# Altium schematic sheet Audio.SchDoc
size A4
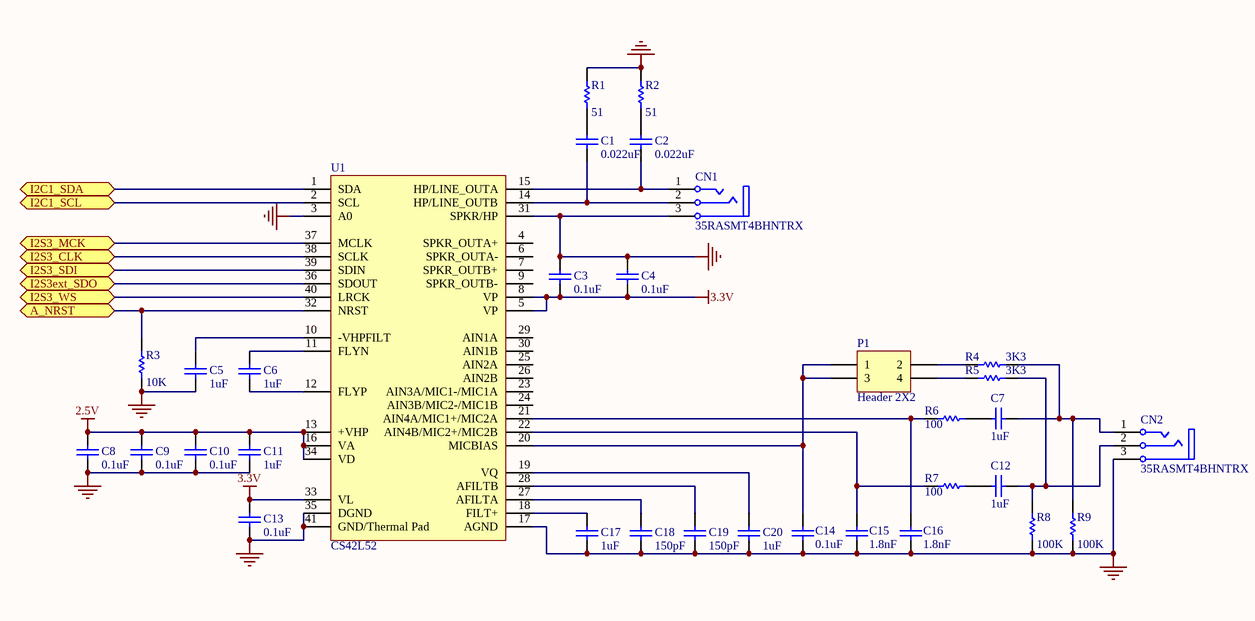
[diagram p0: Audio.SchDoc]

## Parts
C1  value 0.022uF  [CAPC2012N]  (hidden comment: Cap)
C2  value 0.022uF  [CAPC2012N]  (hidden comment: Cap)
C3  value 0.1uF  [CAPC2012N]  (hidden comment: Cap)
C4  value 0.1uF  [CAPC2012N]  (hidden comment: Cap)
C5  value 1uF  [CAPC3216N]  (hidden comment: Cap)
C6  value 1uF  [CAPC3216N]  (hidden comment: Cap)
C7  value 1uF  [CAPC3216N]  (hidden comment: Cap)
C8  value 0.1uF  [CAPC2012N]  (hidden comment: Cap)
C9  value 0.1uF  [CAPC2012N]  (hidden comment: Cap)
C10  value 0.1uF  [CAPC2012N]  (hidden comment: Cap)
C11  value 1uF  [CAPC3216N]  (hidden comment: Cap)
C12  value 1uF  [CAPC3216N]  (hidden comment: Cap)
C13  value 0.1uF  [CAPC2012N]  (hidden comment: Cap)
C14  value 0.1uF  [CAPC2012N]  (hidden comment: Cap)
C15  value 1.8nF  [CAPC2012N]  (hidden comment: Cap)
C16  value 1.8nF  [CAPC2012N]  (hidden comment: Cap)
C17  value 1uF  [CAPC3216N]  (hidden comment: Cap)
C18  value 150pF  [CAPC2012N]  (hidden comment: Cap)
C19  value 150pF  [CAPC2012N]  (hidden comment: Cap)
C20  value 1uF  [CAPC3216N]  (hidden comment: Cap)
CN1  35RASMT4BHNTRX  [35RASMT4BHNTRX]
CN2  35RASMT4BHNTRX  [35RASMT4BHNTRX]
P1  Header 2X2  [HDR2X2]
R1  value 51  [RESC2012N]  (hidden comment: 1206)
R2  value 51  [RESC2012N]  (hidden comment: 1206)
R3  value 10K  [RESC2012N]  (hidden comment: 1206)
R4  value 3K3  [RESC2012N]  (hidden comment: 1206)
R5  value 3K3  [RESC2012N]  (hidden comment: 1206)
R6  value 100  [RESC2012N]  (hidden comment: 1206)
R7  value 100  [RESC2012N]  (hidden comment: 1206)
R8  value 100K  [RESC2012N]  (hidden comment: 1206)
R9  value 100K  [RESC2012N]  (hidden comment: 1206)
U1  CS42L52  [QFN50P600X600X100-40M]

## Ports
A_NRST (bidir), I2C1_SCL (bidir), I2C1_SDA (bidir), I2S3_CLK (bidir), I2S3_MCK (bidir), I2S3_SDI (bidir), I2S3_WS (bidir), I2S3ext_SDO (bidir)

## Nets
2.5V: C8.2 C9.2 C10.2 C11.2 U1.13(+VHP) U1.16(VA) U1.34(VD)
3.3V: C3.1 C4.1 C13.2 U1.5(VP) U1.8(VP) U1.33(VL)
DGND: C3.2 C4.2 C5.1 C8.1 C9.1 C10.1 C11.1 C13.1 C14.2 C15.2 C16.2 C17.1 C18.1 C19.1 C20.1 CN1.3(S) CN2.3(S) R1.2 R2.2 R3.1 R8.1 R9.1 U1.3(A0) U1.17(AGND) U1.31(SPKR/HP) U1.35(DGND) U1.41(GND/Thermal_Pad)
A_NRST: R3.2 U1.32(NRST) ; port A_NRST
I2C1_SCL: U1.2(SCL) ; port I2C1_SCL
I2C1_SDA: U1.1(SDA) ; port I2C1_SDA
I2S3_CLK: U1.38(SCLK) ; port I2S3_CLK
I2S3_MCK: U1.37(MCLK) ; port I2S3_MCK
I2S3_SDI: U1.39(SDIN) ; port I2S3_SDI
I2S3_WS: U1.40(LRCK) ; port I2S3_WS
I2S3ext_SDO: U1.36(SDOUT) ; port I2S3ext_SDO
NetC1_1: C1.1 CN1.2(R) U1.14(HP/LINE_OUTB)
NetC1_2: C1.2 R1.1
NetC2_1: C2.1 CN1.1(T) U1.15(HP/LINE_OUTA)
NetC2_2: C2.2 R2.1
NetC5_2: C5.2 U1.10(-VHPFILT)
NetC6_1: C6.1 U1.12(FLYP)
NetC6_2: C6.2 U1.11(FLYN)
NetC7_1: C7.1 CN2.1(T) R4.1 R9.2
NetC7_2: C7.2 R6.1
NetC12_1: C12.1 CN2.2(R) R5.1 R8.2
NetC12_2: C12.2 R7.1
NetC14_1: C14.1 P1.1 P1.3 U1.20(MICBIAS)
NetC15_1: C15.1 R7.2 U1.22(AIN4B/MIC2+/MIC2B)
NetC16_1: C16.1 R6.2 U1.21(AIN4A/MIC1+/MIC2A)
NetC17_2: C17.2 U1.18(FILT+)
NetC18_2: C18.2 U1.27(AFILTA)
NetC19_2: C19.2 U1.28(AFILTB)
NetC20_2: C20.2 U1.19(VQ)
NetP1_2: P1.2 R4.2
NetP1_4: P1.4 R5.2

Not connected (* = marked no-connect by the designer): U1 4(SPKR_OUTA+) 6(SPKR_OUTA-) 7(SPKR_OUTB+) 9(SPKR_OUTB-) 23(AIN3A/MIC1-/MIC1A) 24(AIN3B/MIC2-/MIC1B) 25(AIN2A) 26(AIN2B) 29(AIN1A) 30(AIN1B)

## Library data of the parts
C1-C20 = Cap: Capacitor
CN1 CN2 = Phonejack3: 3.5mm Stereo Jack
P1 = Header 2X2: Header, 2-Pin, Dual row
R1-R9 = Res: Resistor
U1 = CS42L52: Low-power, Stereo CODEC w/ Headphone & Speaker Amps